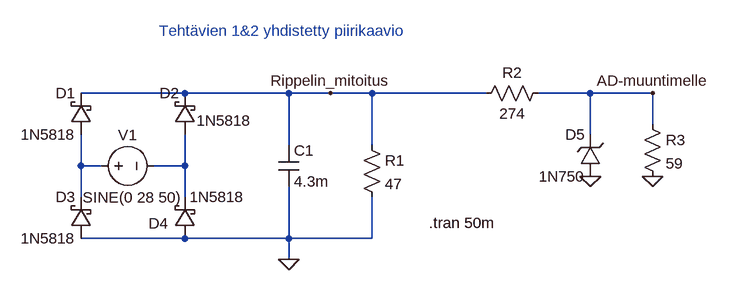
[diagram p0: schematic HT_teht1_2.asc]
HT_teht1_2.asc, the LTspice schematic file:
Version 4
SHEET 1 1016 680
WIRE 176 96 16 96
WIRE 336 96 176 96
WIRE 400 96 336 96
WIRE 464 96 400 96
WIRE 640 96 464 96
WIRE 800 96 720 96
WIRE 896 96 800 96
WIRE 896 144 896 96
WIRE 800 160 800 96
WIRE 336 176 336 96
WIRE 464 176 464 96
WIRE 16 208 16 160
WIRE 48 208 16 208
WIRE 176 208 176 160
WIRE 176 208 128 208
WIRE 16 256 16 208
WIRE 176 256 176 208
WIRE 176 320 16 320
WIRE 336 320 336 240
WIRE 336 320 176 320
WIRE 464 320 464 256
WIRE 464 320 336 320
WIRE 336 352 336 320
FLAG 336 352 0
FLAG 800 224 0
FLAG 896 224 0
FLAG 896 96 AD-muuntimelle
FLAG 400 96 Rippelin_mitoitus
SYMBOL schottky 32 160 R180
WINDOW 0 24 64 Left 2
WINDOW 3 24 0 Left 2
SYMATTR InstName D1
SYMATTR Value 1N5818
SYMATTR Description Diode
SYMATTR Type diode
SYMBOL schottky 192 160 R180
WINDOW 0 24 64 Left 2
WINDOW 3 -87 22 Left 2
SYMATTR InstName D2
SYMATTR Value 1N5818
SYMATTR Description Diode
SYMATTR Type diode
SYMBOL schottky 32 320 R180
WINDOW 0 24 64 Left 2
WINDOW 3 24 0 Left 2
SYMATTR InstName D3
SYMATTR Value 1N5818
SYMATTR Description Diode
SYMATTR Type diode
SYMBOL schottky 192 320 R180
WINDOW 0 41 23 Left 2
WINDOW 3 -76 64 Left 2
SYMATTR InstName D4
SYMATTR Value 1N5818
SYMATTR Description Diode
SYMATTR Type diode
SYMBOL voltage 32 208 R270
WINDOW 0 32 56 VTop 2
WINDOW 3 -33 63 VBottom 2
WINDOW 123 0 0 Left 2
WINDOW 39 0 0 Left 2
SYMATTR InstName V1
SYMATTR Value SINE(0 28 50)
SYMBOL cap 320 176 R0
SYMATTR InstName C1
SYMATTR Value 4.3m
SYMBOL res 448 160 R0
SYMATTR InstName R1
SYMATTR Value 47
SYMBOL res 736 80 R90
WINDOW 0 0 56 VBottom 2
WINDOW 3 32 56 VTop 2
SYMATTR InstName R2
SYMATTR Value 274
SYMBOL res 880 128 R0
SYMATTR InstName R3
SYMATTR Value 59
SYMBOL zener 816 224 R180
WINDOW 0 24 64 Left 2
WINDOW 3 24 0 Left 2
SYMATTR InstName D5
SYMATTR Value 1N750
TEXT 552 296 Left 2 !.tran 50m
TEXT 136 0 Left 2 ;Tehtävien 1&2 yhdistetty piirikaavio

The netlist it stands for:
* HT_teht1_2.asc
D1 N001 Rippelin_mitoitus 1N5818
D2 N002 Rippelin_mitoitus 1N5818
D3 0 N001 1N5818
D4 0 N002 1N5818
V1 N001 N002 SINE(0 28 50)
C1 Rippelin_mitoitus 0 4.3m
R1 Rippelin_mitoitus 0 47
R2 AD-muuntimelle Rippelin_mitoitus 274
R3 AD-muuntimelle 0 59
D5 0 AD-muuntimelle 1N750
.model D D
.lib standard.dio
.tran 50m
* Tehtävien 1&2 yhdistetty piirikaavio
.backanno
.end

* Results of the author's LTspice run, read from the files saved beside the schematic
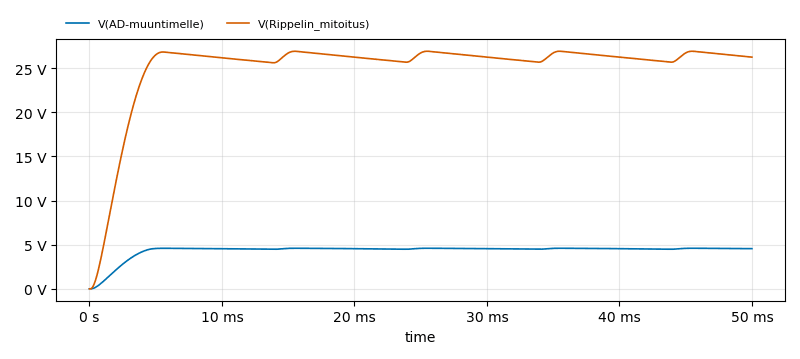
[diagram p1: Transient Analysis of HT_teht1_2.asc, plotted from the saved traces]
* Transient Analysis, 1 run:
*   V(AD-muuntimelle): min 0 V, max 4.599 V, average 4.354 V, rms 4.423 V, last 4.553 V
*   V(Rippelin_mitoitus): min 0 V, max 26.92 V, average 25.15 V, rms 25.55 V, last 26.25 V